# EAGLE design USB_Cocoon (EAGLE 5.04)
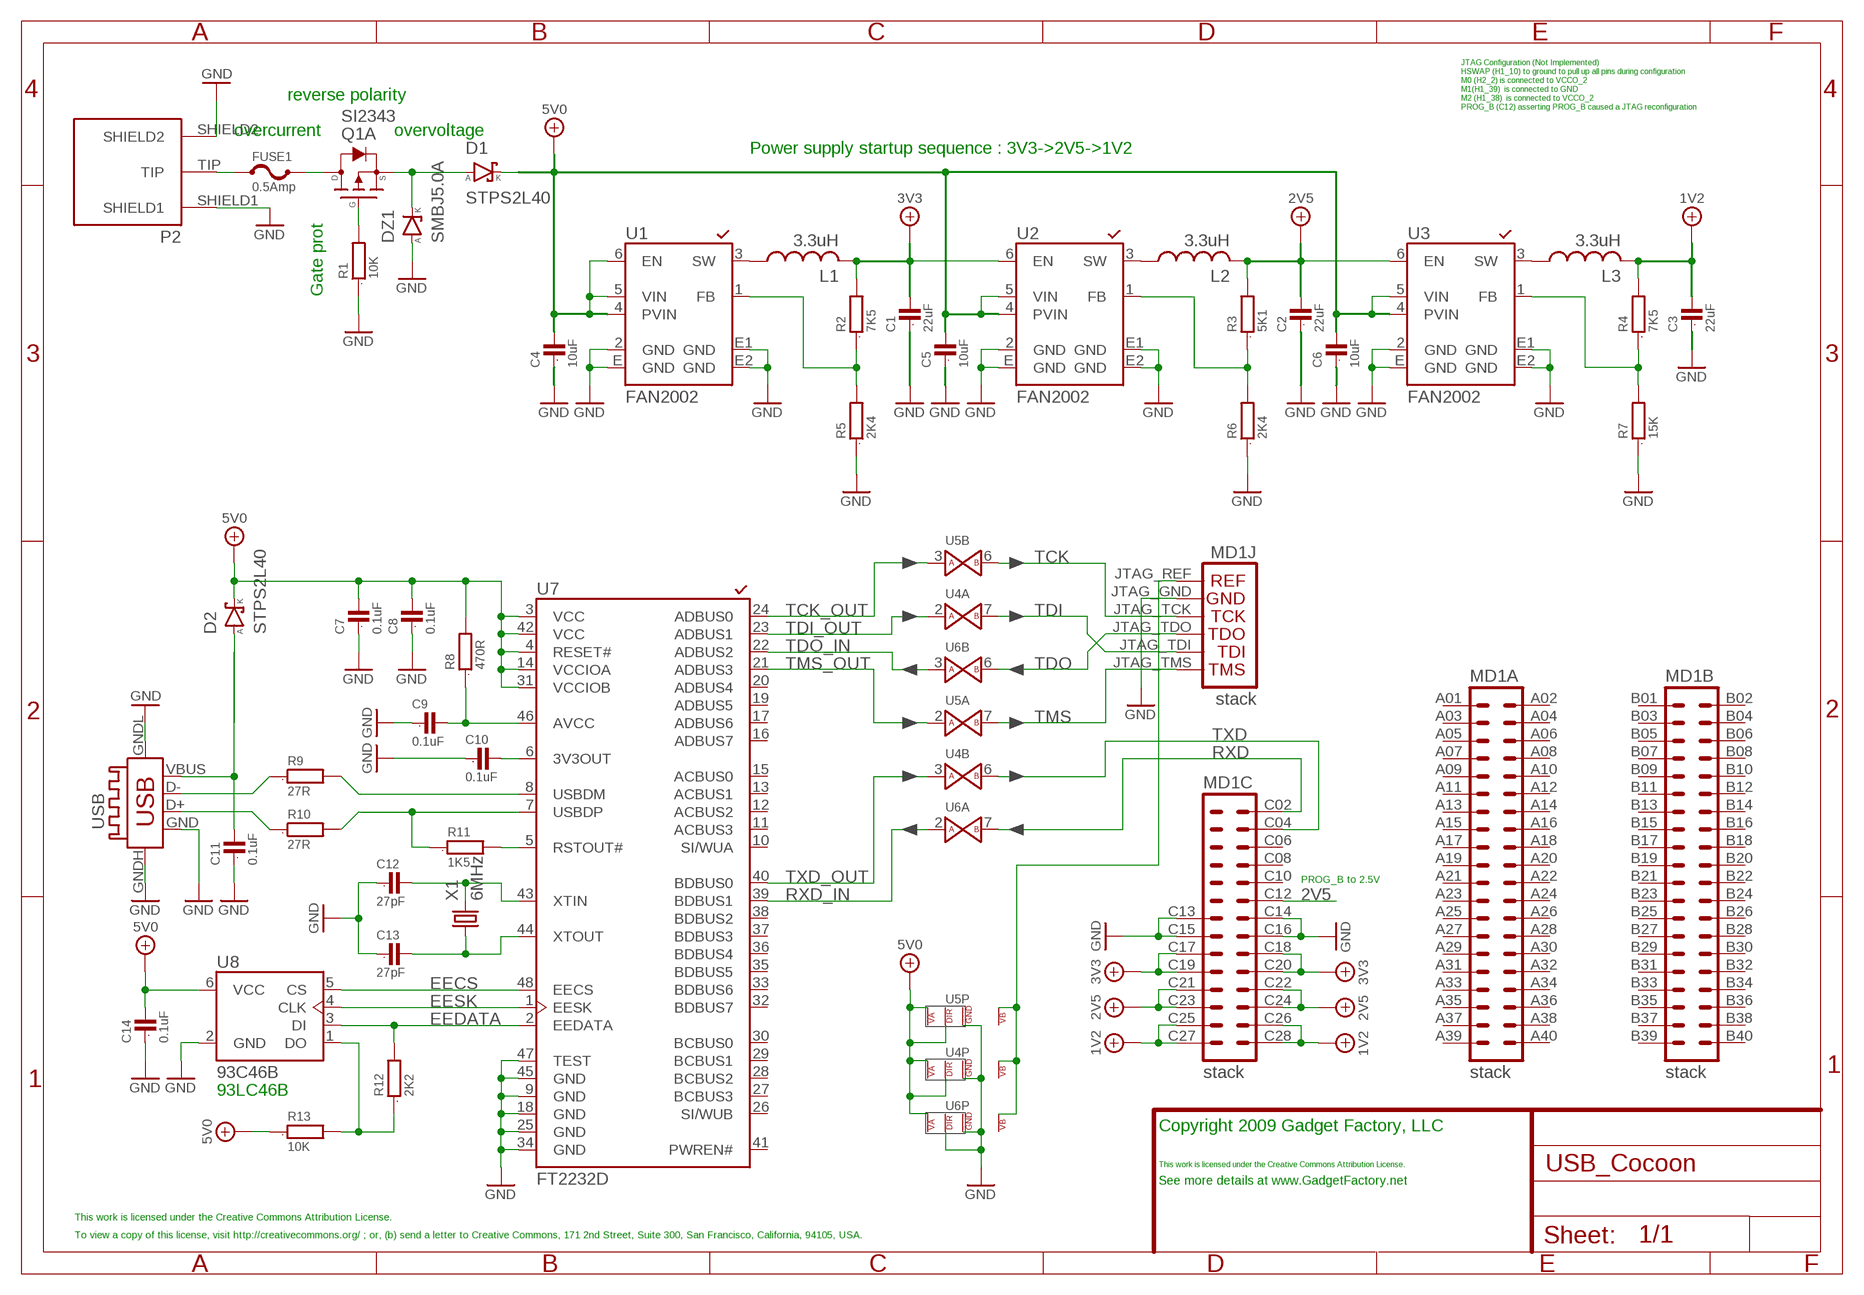
[diagram p0: schematic, sheet 1]

## Parts
C1  22uF  C0805  [0805]
C2  22uF  C0805  [0805]
C3  22uF  C0805  [0805]
C4  10uF  C0805  [0805]
C5  10uF  C0805  [0805]
C6  10uF  C0805  [0805]
C7  0.1uF  C0402  [0402]
C8  0.1uF  C0402  [0402]
C9  0.1uF  C0402  [0402]
C10  0.1uF  C0402  [0402]
C11  0.1uF  C0805  [0805]
C12  27pF  C0603  [0603]
C13  27pF  C0603  [0603]
C14  0.1uF  C0402  [0402]
D1  STPS2L40  DIODE-SCHOTTKY_SMB  [SMB]
D2  STPS2L40  DIODE-SCHOTTKY_SMB  [SMB]
DZ1  SMBJ5.0A  DIODE-ZENER_SMB  [SMB]
FUSE1  0.5Amp  FUSE1812  [1812]
L1  3.3uH  L-US1210  [1210]
L2  3.3uH  L-US1210  [1210]
L3  3.3uH  L-US1210  [1210]
MD1  stack  GADGETFACTORY_STACK  [GADGETFACTORY_STACK]
P2  POWER_JACK1THROUGH-HOLE  [POWER_JACK1]
Q1  SI2343  TRANSISTOR-MOSFET-P-ENH_SOT23-1  [SOT23]
R1  10K  R0402  [0402]
R2  7K5  R0402  [0402]
R3  5K1  R0402  [0402]
R4  7K5  R0402  [0402]
R5  2K4  R0402  [0402]
R6  2K4  R0402  [0402]
R7  15K  R0402  [0402]
R8  470R  R0402  [0402]
R9  27R  R0402  [0402]
R10  27R  R0402  [0402]
R11  1K5  R0402  [0402]
R12  2K2  R0402  [0402]
R13  10K  R0402  [0402]
U1  FAN2002  [MLP6]
U2  FAN2002  [MLP6]
U3  FAN2002  [MLP6]
U4  SN74LVC2T45  DIGITAL-TRANSLATOR-2G-DUAL_DCT  [MSOP8]
U5  SN74LVC2T45  DIGITAL-TRANSLATOR-2G-DUAL_DCT  [MSOP8]
U6  SN74LVC2T45  DIGITAL-TRANSLATOR-2G-DUAL_DCT  [MSOP8]
U7  FT2232D  [LQFP48]
U8  93C46B  DIGITAL-EEPROM-MICROWIRE-6P_SOT23  [SOT23-6]
USB  CON-USB-B  [USB-B-H]
X1  6MHz  CRYSTALHC49S  [HC49/S]

## Nets
1V2: C3.2 L3.2 MD1.C25(C:C25) MD1.C26(C:C26) MD1.C27(C:C27) MD1.C28(C:C28) R4.2
2V5: C2.2 L2.2 MD1.C12(C:C12) MD1.C21(C:C21) MD1.C22(C:C22) MD1.C23(C:C23) MD1.C24(C:C24) R3.2 U3.6(EN)
3V3: C1.2 L1.2 MD1.C17(C:C17) MD1.C18(C:C18) MD1.C19(C:C19) MD1.C20(C:C20) R2.2 U2.6(EN)
3V3OUT: C10.2 U7.6(3V3OUT)
5V0: C4.2 C5.2 C6.2 C7.2 C8.2 C14.2 D1.K D2.K R8.2 R13.1 U1.4(PVIN) U1.5(VIN) U1.6(EN) U2.4(PVIN) U2.5(VIN) U3.4(PVIN) U3.5(VIN) U4.1(P:VCCA) U4.5(P:DIR) U5.1(P:VCCA) U5.5(P:DIR) U6.1(P:VCCA) U7.3(VCC) U7.4(RESET#) U7.14(VCCIOA) U7.31(VCCIOB) U7.42(VCC) U8.6(VCC)
12V_FUSED: FUSE1.2 Q1.3(A:D)
12V_PROT: D1.A DZ1.K Q1.2(A:S)
D+: R10.1 USB.D+
D-: R9.1 USB.D-
DO: R12.1 R13.2 U8.1(DO)
EECS: U7.48(EECS) U8.5(CS)
EEDATA: R12.2 U7.2(EEDATA) U8.3(DI)
EESK: U7.1(EESK) U8.4(CLK)
FILTERED_VCC: C9.2 R8.1 U7.46(AVCC)
GND: C1.1 C2.1 C3.1 C4.1 C5.1 C6.1 C7.1 C8.1 C9.1 C10.1 C11.1 C12.1 C13.1 C14.1 DZ1.A MD1.C13(C:C13) MD1.C14(C:C14) MD1.C15(C:C15) MD1.C16(C:C16) MD1.JTAG_GND(J:JTAG_GND) P2.SHIELD1 P2.SHIELD2 R1.1 R5.1 R6.1 R7.1 U1.2(GND) U1.E1(GND) U1.E2(GND) U1.E(GND) U2.2(GND) U2.E1(GND) U2.E2(GND) U2.E(GND) U3.2(GND) U3.E1(GND) U3.E2(GND) U3.E(GND) U4.4(P:GND) U5.4(P:GND) U6.4(P:GND) U6.5(P:DIR) U7.9(GND) U7.18(GND) U7.25(GND) U7.34(GND) U7.45(GND) U7.47(TEST) U8.2(GND) USB.GND USB.GNDH USB.GNDL
N$1: L3.1 U3.3(SW)
N$2: L2.1 U2.3(SW)
N$3: R4.1 R7.2 U3.1(FB)
N$7: R3.1 R6.2 U2.1(FB)
N$8: L1.1 U1.3(SW)
N$9: R2.1 R5.2 U1.1(FB)
N$15: R11.2 U7.5(RSTOUT#)
REV_PROT_GATE: Q1.1(G:G) R1.2
RXD: MD1.C02(C:C02) U6.7(A:B)
RXD_IN: U6.2(A:A) U7.39(BDBUS1)
TCK: MD1.JTAG_TCK(J:JTAG_TCK) U5.6(B:B)
TCK_OUT: U5.3(B:A) U7.24(ADBUS0)
TDI: MD1.JTAG_TDI(J:JTAG_TDI) U4.7(A:B)
TDI_OUT: U4.2(A:A) U7.23(ADBUS1)
TDO: MD1.JTAG_TDO(J:JTAG_TDO) U6.6(B:B)
TDO_IN: U6.3(B:A) U7.22(ADBUS2)
TIP: FUSE1.1 P2.TIP
TMS: MD1.JTAG_TMS(J:JTAG_TMS) U5.7(A:B)
TMS_OUT: U5.2(A:A) U7.21(ADBUS3)
TXD: MD1.C04(C:C04) U4.6(B:B)
TXD_OUT: U4.3(B:A) U7.40(BDBUS0)
USBDM: R9.2 U7.8(USBDM)
USBDP: R10.2 R11.1 U7.7(USBDP)
VBUS: C11.2 D2.A USB.VBUS
VREF_BUF: MD1.JTAG_REF(J:JTAG_REF) U4.8(P:VCCB) U5.8(P:VCCB) U6.8(P:VCCB)
XTIN: C12.2 U7.43(XTIN) X1.2
XTOUT: C13.2 U7.44(XTOUT) X1.1
Unconnected: MD1.A01(A:A01) MD1.A02(A:A02) MD1.A03(A:A03) MD1.A04(A:A04) MD1.A05(A:A05) MD1.A06(A:A06) MD1.A07(A:A07) MD1.A08(A:A08) MD1.A09(A:A09) MD1.A10(A:A10) MD1.A11(A:A11) MD1.A12(A:A12) MD1.A13(A:A13) MD1.A14(A:A14) MD1.A15(A:A15) MD1.A16(A:A16) MD1.A17(A:A17) MD1.A18(A:A18) MD1.A19(A:A19) MD1.A20(A:A20) MD1.A21(A:A21) MD1.A22(A:A22) MD1.A23(A:A23) MD1.A24(A:A24) MD1.A25(A:A25) MD1.A26(A:A26) MD1.A27(A:A27) MD1.A28(A:A28) MD1.A29(A:A29) MD1.A30(A:A30) MD1.A31(A:A31) MD1.A32(A:A32) MD1.A33(A:A33) MD1.A34(A:A34) MD1.A35(A:A35) MD1.A36(A:A36) MD1.A37(A:A37) MD1.A38(A:A38) MD1.A39(A:A39) MD1.A40(A:A40) MD1.B01(B:B01) MD1.B02(B:B02) MD1.B03(B:B03) MD1.B04(B:B04) MD1.B05(B:B05) MD1.B06(B:B06) MD1.B07(B:B07) MD1.B08(B:B08) MD1.B09(B:B09) MD1.B10(B:B10) MD1.B11(B:B11) MD1.B12(B:B12) MD1.B13(B:B13) MD1.B14(B:B14) MD1.B15(B:B15) MD1.B16(B:B16) MD1.B17(B:B17) MD1.B18(B:B18) MD1.B19(B:B19) MD1.B20(B:B20) MD1.B21(B:B21) MD1.B22(B:B22) MD1.B23(B:B23) MD1.B24(B:B24) MD1.B25(B:B25) MD1.B26(B:B26) MD1.B27(B:B27) MD1.B28(B:B28) MD1.B29(B:B29) MD1.B30(B:B30) MD1.B31(B:B31) MD1.B32(B:B32) MD1.B33(B:B33) MD1.B34(B:B34) MD1.B35(B:B35) MD1.B36(B:B36) MD1.B37(B:B37) MD1.B38(B:B38) MD1.B39(B:B39) MD1.B40(B:B40) MD1.C06(C:C06) MD1.C08(C:C08) MD1.C10(C:C10) U7.10(SI/WUA) U7.11(ACBUS3) U7.12(ACBUS2) U7.13(ACBUS1) U7.15(ACBUS0) U7.16(ADBUS7) U7.17(ADBUS6) U7.19(ADBUS5) U7.20(ADBUS4) U7.26(SI/WUB) U7.27(BCBUS3) U7.28(BCBUS2) U7.29(BCBUS1) U7.30(BCBUS0) U7.32(BDBUS7) U7.33(BDBUS6) U7.35(BDBUS5) U7.36(BDBUS4) U7.37(BDBUS3) U7.38(BDBUS2) U7.41(PWREN#)

## Notes on the sheet
- JTAG Configuration (Not Implemented)
- HSWAP (H1_10) to ground to pull up all pins during configuration
- M0 (H2_2) is connected to VCCO_2
- M1(H1_39)  is connected to GND
- reverse polarity | M2 (H1_38)  is connected to VCCO_2
- PROG_B (C12) asserting PROG_B caused a JTAG reconfiguration
- overcurrent | overvoltage
- Power supply startup sequence : 3V3->2V5->1V2
- Gate prot
- PROG_B to 2.5V
- 93LC46B
- Copyright 2009 Gadget Factory, LLC
- This work is licensed under the Creative Commons Attribution License.
- See more details at www.GadgetFactory.net
- This work is licensed under the Creative Commons Attribution License.
- To view a copy of this license, visit http://creativecommons.org/ ; or, (b) send a letter to Creative Commons, 171 2nd Street, Suite 300, San Francisco, California, 94105, USA.

## Library data of the parts
C1-C14 = Bogdan_Commons:C: CAPACITOR, European symbol
D1 D2 = Bogdan_Commons:DIODE-SCHOTTKY
DZ1 = Bogdan_Commons:DIODE-ZENER
FUSE1 = GadgetFactory:FUSE
L1-L3 = GadgetFactory:L-US: INDUCTOR, American symbol
MD1 = GadgetFactory:GADGETFACTORY_STACK
P2 = GadgetFactory:POWER_JACK1
Q1 = Bogdan_Commons:TRANSISTOR-MOSFET-P-ENH
R1-R13 = Bogdan_Commons:R: RESISTOR, European symbol
U1-U3 = Bogdan_Commons:FAN2002
U4-U6 = Bogdan_Commons:DIGITAL-TRANSLATOR-2G-DUAL: SN74LVC2T45
U7 = Bogdan_Commons:FT2232D
U8 = Bogdan_Commons:DIGITAL-EEPROM-MICROWIRE-6P
USB = Bogdan_Commons:CON-USB-B
X1 = crystal:CRYSTAL: CRYSTAL

## Net classes
0 default: width 0.15 mm, drill 0.2 mm, clearance 0.125 mm

## Board
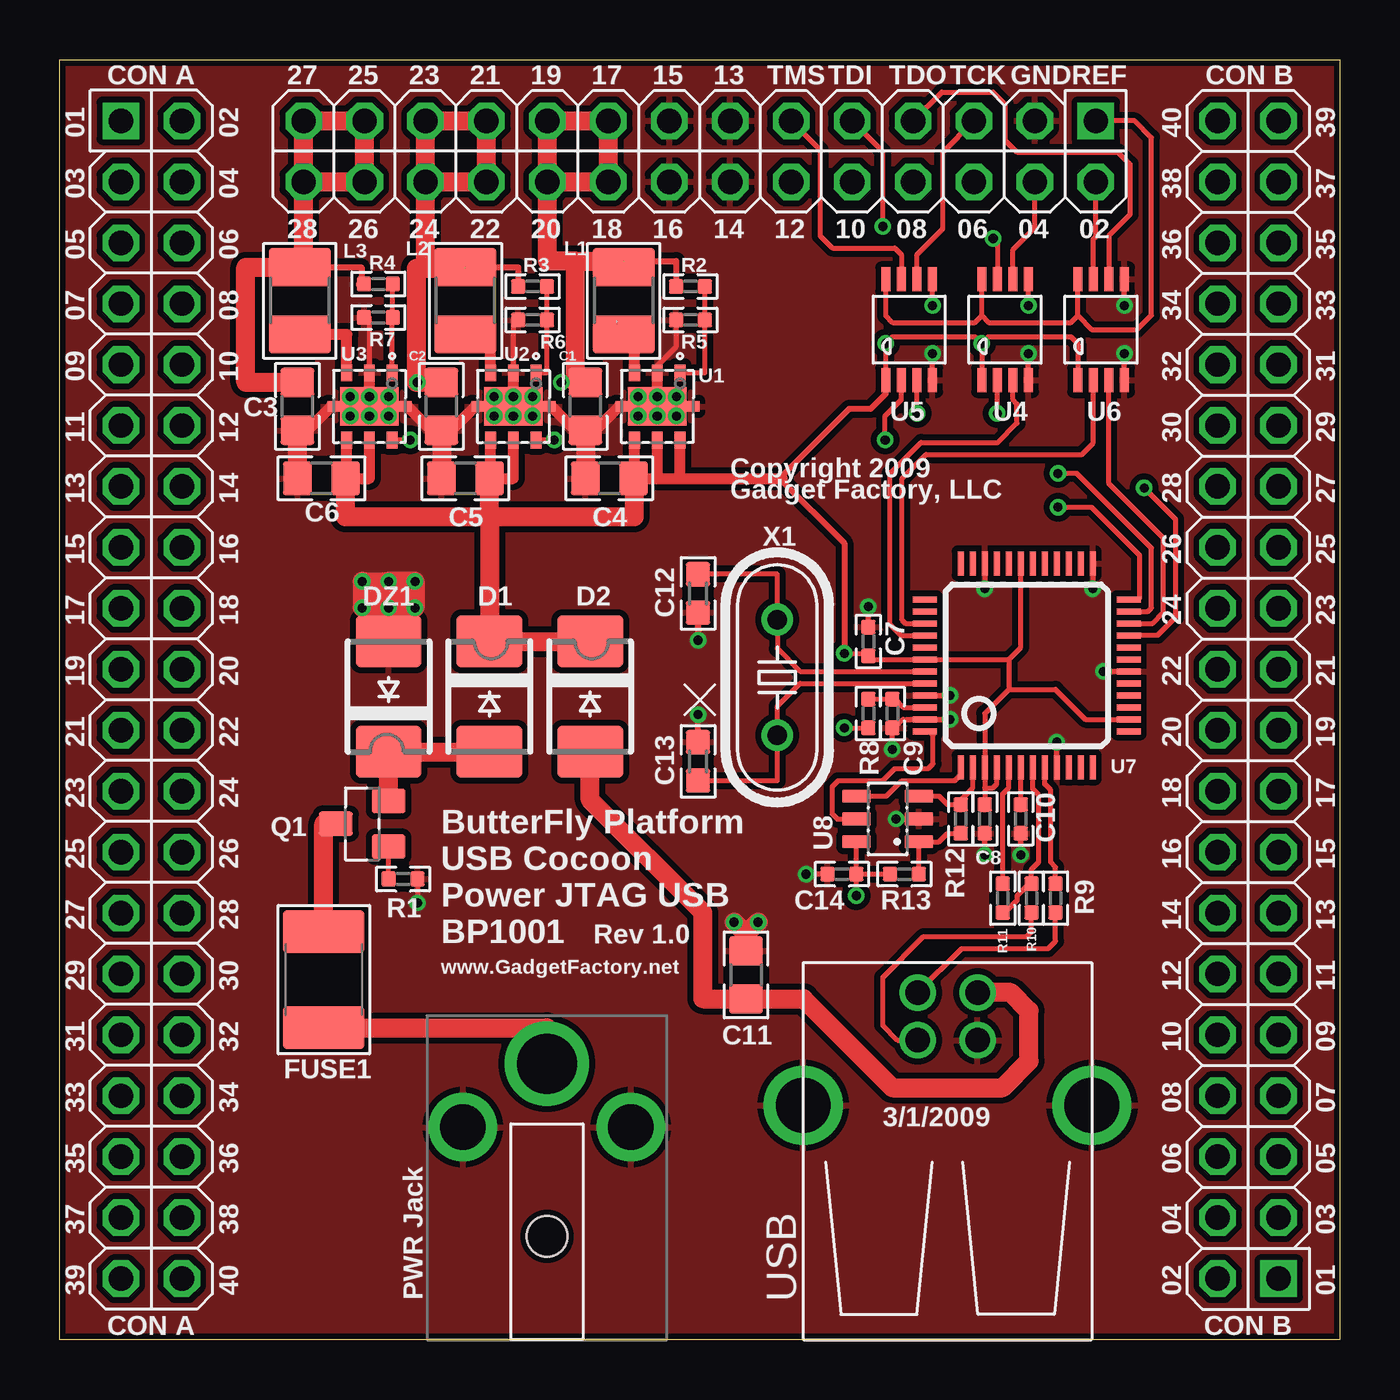
[diagram p1: board, top side]
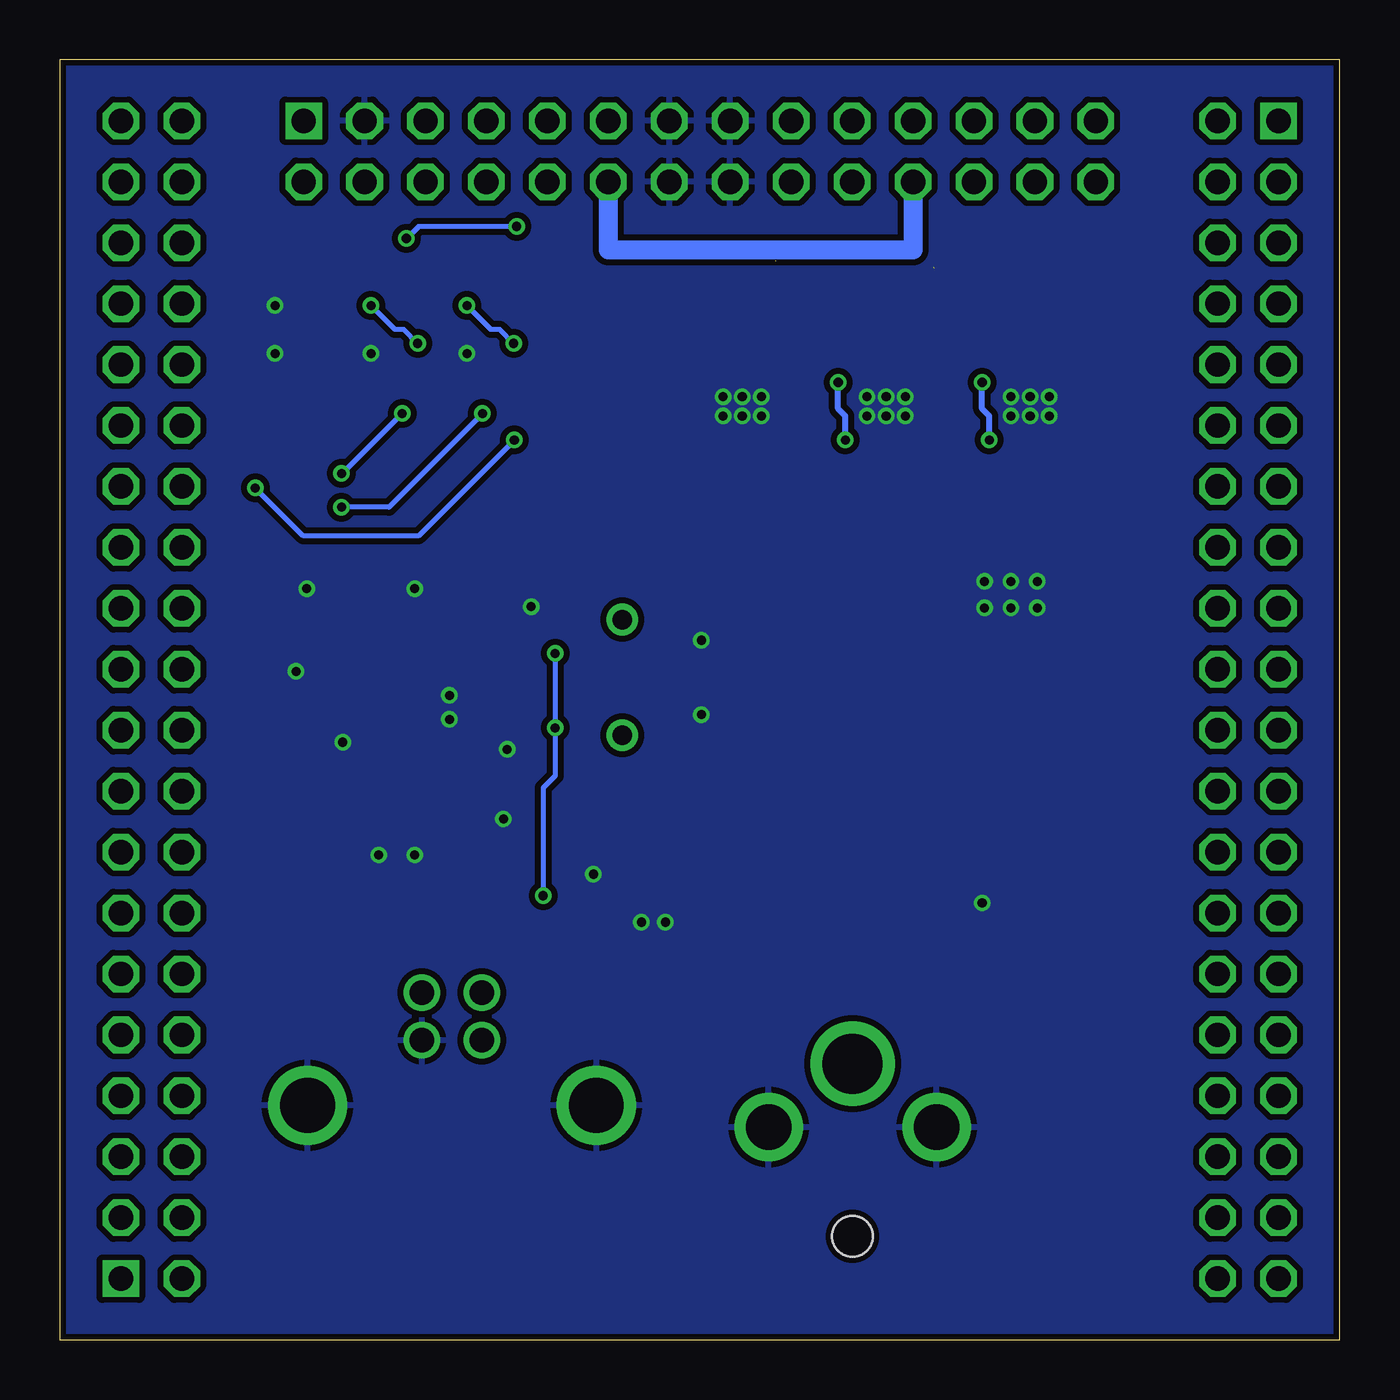
[diagram p2: board, bottom side, seen from below]

Size 53.34 x 53.34 mm. Coordinates in mm from the lower left corner, seen from the top.
Copper layers (1*16): Top 0.035mm / dielectric 1mm / Bottom 0.035mm
Design rules "default *": minimum track width 0.2mm, minimum drill 15mil, track to track 0.25mm, track to pad 0.25mm, pad to pad 0.25mm, via to via 0.25mm, smd to smd 0mil, copper to edge 10mil, drill to drill 8mil, minimum pad ring 10mil, minimum via ring 6mil, stop-mask expansion 4mil, vias tented up to drill 25mil, thermal gap 10mil

### Footprints (pad centres in the part's own frame; a part is rotated, then mirrored left to right if it is on the bottom)
0805 = smd 1.2 x 1.4: 1 -1,0; 2 1,0
0402 = smd 0.6 x 0.6: 1 -0.6,0; 2 0.6,0
0603 = smd 1 x 1: 1 -0.8,0; 2 0.8,0
SMB = smd 2.159 x 2.743: A 2.3,0; K -2.3,0
1812 = smd 1.8 x 3.4: 1 -2,0; 2 2,0
1210 = smd 1.6 x 2.6: 1 -1.4,0; 2 1.4,0
GADGETFACTORY_STACK = drill 1.016 square: A01 2.54,50.8; B01 50.8,2.54; JTAG_REF 43.18,50.8 | drill 1.016 octagon: A02 5.08,50.8; A03 2.54,48.26; A04 5.08,48.26; A05 2.54,45.72; A06 5.08,45.72; A07 2.54,43.18; A08 5.08,43.18; A09 2.54,40.64; A10 5.08,40.64; A11 2.54,38.1; A12 5.08,38.1; A13 2.54,35.56; A14 5.08,35.56; A15 2.54,33.02; A16 5.08,33.02; A17 2.54,30.48; A18 5.08,30.48; A19 2.54,27.94; A20 5.08,27.94; A21 2.54,25.4; A22 5.08,25.4; A23 2.54,22.86; A24 5.08,22.86; A25 2.54,20.32; A26 5.08,20.32; A27 2.54,17.78; A28 5.08,17.78; A29 2.54,15.24; A30 5.08,15.24; A31 2.54,12.7; A32 5.08,12.7; A33 2.54,10.16; A34 5.08,10.16; A35 2.54,7.62; A36 5.08,7.62; A37 2.54,5.08; A38 5.08,5.08; A39 2.54,2.54; A40 5.08,2.54; B02 48.26,2.54; B03 50.8,5.08; B04 48.26,5.08; B05 50.8,7.62; B06 48.26,7.62; B07 50.8,10.16; B08 48.26,10.16; B09 50.8,12.7; B10 48.26,12.7; B11 50.8,15.24; B12 48.26,15.24; B13 50.8,17.78; B14 48.26,17.78; B15 50.8,20.32; B16 48.26,20.32; B17 50.8,22.86; B18 48.26,22.86; B19 50.8,25.4; B20 48.26,25.4; B21 50.8,27.94; B22 48.26,27.94; B23 50.8,30.48; B24 48.26,30.48; B25 50.8,33.02; B26 48.26,33.02; B27 50.8,35.56; B28 48.26,35.56; B29 50.8,38.1; B30 48.26,38.1; B31 50.8,40.64; B32 48.26,40.64; B33 50.8,43.18; B34 48.26,43.18; B35 50.8,45.72; B36 48.26,45.72; B37 50.8,48.26; B38 48.26,48.26; B39 50.8,50.8; B40 48.26,50.8; C02 43.18,48.26; C04 40.64,48.26; C06 38.1,48.26; C08 35.56,48.26; C10 33.02,48.26; C12 30.48,48.26; C13 27.94,50.8; C14 27.94,48.26; C15 25.4,50.8; C16 25.4,48.26; C17 22.86,50.8; C18 22.86,48.26; C19 20.32,50.8; C20 20.32,48.26; C21 17.78,50.8; C22 17.78,48.26; C23 15.24,50.8; C24 15.24,48.26; C25 12.7,50.8; C26 12.7,48.26; C27 10.16,50.8; C28 10.16,48.26; JTAG_GND 40.64,50.8; JTAG_TCK 38.1,50.8; JTAG_TDI 33.02,50.8; JTAG_TDO 35.56,50.8; JTAG_TMS 30.48,50.8
POWER_JACK1 = drill 1.9 round: SHIELD1 -3.5,2.65; SHIELD2 3.5,2.65 | drill 2.5 round: TIP 0,0 | hole 1.7: 0,7.2
SOT23 = smd 1 x 1.4: 1 -0.95,-1.1; 2 0.95,-1.1; 3 0,1.1
MLP6 = smd 0.45 x 0.7: 1 -0.95,-1.4; 2 0,-1.4; 3 0.95,-1.4; 4 0.95,1.4; 5 0,1.4; 6 -0.95,1.4 | smd 2.45 x 1.6: E 0,0 | smd 0.7 x 0.45: E1 -1.4,0; E2 1.4,0
MSOP8 = smd 0.38 x 1: 1 -0.975,-2.1; 2 -0.325,-2.1; 3 0.325,-2.1; 4 0.975,-2.1; 5 0.975,2.1; 6 0.325,2.1; 7 -0.325,2.1; 8 -0.975,2.1
LQFP48 = smd 0.25 x 1: 1 -2.75,-4.25; 2 -2.25,-4.25; 3 -1.75,-4.25; 4 -1.25,-4.25; 5 -0.75,-4.25; 6 -0.25,-4.25; 7 0.25,-4.25; 8 0.75,-4.25; 9 1.25,-4.25; 10 1.75,-4.25; 11 2.25,-4.25; 12 2.75,-4.25; 25 2.75,4.25; 26 2.25,4.25; 27 1.75,4.25; 28 1.25,4.25; 29 0.75,4.25; 30 0.25,4.25; 31 -0.25,4.25; 32 -0.75,4.25; 33 -1.25,4.25; 34 -1.75,4.25; 35 -2.25,4.25; 36 -2.75,4.25 | smd 1 x 0.25: 13 4.25,-2.75; 14 4.25,-2.25; 15 4.25,-1.75; 16 4.25,-1.25; 17 4.25,-0.75; 18 4.25,-0.25; 19 4.25,0.25; 20 4.25,0.75; 21 4.25,1.25; 22 4.25,1.75; 23 4.25,2.25; 24 4.25,2.75; 37 -4.25,2.75; 38 -4.25,2.25; 39 -4.25,1.75; 40 -4.25,1.25; 41 -4.25,0.75; 42 -4.25,0.25; 43 -4.25,-0.25; 44 -4.25,-0.75; 45 -4.25,-1.25; 46 -4.25,-1.75; 47 -4.25,-2.25; 48 -4.25,-2.75
SOT23-6 = smd 0.55 x 1.2: 1 -0.95,-1.3; 2 0,-1.3; 3 0.95,-1.3; 4 0.95,1.3; 5 0,1.3; 6 -0.95,1.3
USB-B-H = drill 1.016 round: D+ 5.08,1.25; D- 7.061,1.25; GND 5.08,-1.25; VBUS 7.061,-1.25 | drill 2.286 round: GNDH 2.362,6.02; GNDL 2.362,-6.02
HC49/S = drill 0.813 round: 1 -2.413,0; 2 2.413,0

### Placement (x,y rotation side)
C1  21.9,38.9 90 top
C2  15.9,38.9 90 top
C3  9.9,38.9 90 top
C4  22.9,35.9 0 top
C5  16.9,35.9 0 top
C6  10.9,35.9 0 top
C7  33.7,29.1 270 top
C8  38.55,21.7 90 top
C9  34.7,26.1 90 top
C10  40.05,21.7 90 top
C11  28.6,15.2 270 top
C12  26.6,31.1 90 top
C13  26.6,24.1 270 top
C14  32.6,19.4 0 top
D1  17.9,26.8 270 top
D2  22.1,26.8 270 top
DZ1  13.7,26.8 90 top
FUSE1  11,15 90 top
L1  23.5,43.3 90 top
L2  16.9,43.3 90 top
L3  10,43.3 90 top
MD1  0,0 0 top
P2  20.3,11.5 180 top
Q1  12.6,21.5 90 top
R1  14.3,19.2 180 top
R2  26.28,43.9 180 top
R3  19.7,43.9 180 top
R4  13.27,44 180 top
R5  26.28,42.5 0 top
R6  19.7,42.5 0 top
R7  13.27,42.6 0 top
R8  33.7,26.1 270 top
R9  41.5,18.4 90 top
R10  40.5,18.4 90 top
R11  39.3,18.4 90 top
R12  37.55,21.7 90 top
R13  35.2,19.4 0 top
U1  24.9,38.9 180 top
U2  18.9,38.9 180 top
U3  12.9,38.9 180 top
U4  39.4,42.1 0 top
U5  35.4,42.1 0 top
U6  43.4,42.1 0 top
U7  40.3,28.1 0 top
U8  34.5,21.7 90 top
USB  37,7.4 90 top
X1  29.9,27.6 90 top

### Tracks (layer width: path | path; a pad name or v marks a point on that pad's centre or on a via)
1V2
  Top 0.25: 12.57,43.98 12.57,44.7 L3.2
  Top 0.45: R4.2 12.67,43.98 12.57,43.98
  Top 0.8: MD1.C28 MD1.C27 MD1.C25 MD1.C26 MD1.C28 | C3.2 7.75,39.9 7.75,44.7 L3.2 10.16,44.7 MD1.C28 | MD1.C28 10.03,48.26
2V5  (via drill 0.38)  (1 unrouted)
  Top 0.25: v14.9,39.9 15.57,39.9 | U3.6 v14.6,37.5 | R3.2 19.1,44.7 L2.2
  Top 0.8: 15.57,39.9 C2.2 14.86,39.9 14.86,44.66 | MD1.C24 MD1.C23 MD1.C21 MD1.C22 MD1.C24 | 14.86,44.66 16.89,44.66 | 14.86,44.66 15.24,44.66 MD1.C24
  Bottom 0.25: v14.6,37.5 14.6,38.5 14.9,38.8 v14.9,39.9
  Bottom 0.8: MD1.C12 30.48,45.42 17.78,45.42 MD1.C22
3V3  (via drill 0.38)  (1 unrouted)
  Top 0.25: v20.9,39.9 21.48,39.9 | U2.6 v20.6,37.5 | 23.51,44.96 25.68,44.96 R2.2
  Top 0.8: MD1.C20 MD1.C19 MD1.C17 MD1.C18 MD1.C20 | C1.2 21.48,39.9 21.48,44.96 | MD1.C20 20.32,44.96 21.48,44.96 | 21.48,44.96 23.5,44.96 L1.2
  Bottom 0.25: v20.6,37.5 20.6,38.5 20.9,38.8 v20.9,39.9
3V3OUT
  Top 0.2: C10.2 U7.6
5V0  (via drill 0.38)
  Top 0.2: 38.55,23 C8.2 | 38.55,23 U7.3 38.55,26.1 39.55,27.1 | C14.2 U8.6 | C14.2 R13.1 | 38.55,23 38.9,23 39.05,23.15 U7.4 | 39.55,28.35 U7.42 33.7,28.35 C7.2 33.7,28.6 v32.7,28.6 | U7.31 40.05,28.85 39.55,28.35 | 39.55,28.35 39.55,27.1 | U7.14 42.75,25.85 41.5,27.1 39.55,27.1 | U5.1 v34.42,41.52 34.7,41.8 38.15,41.8 v38.42,41.52 | v38.42,41.52 U4.1 | U6.1 42.42,41.52 42.15,41.8 38.7,41.8 v38.42,41.52 | v40.38,43.1 U4.5 | v36.38,43.1 U5.5 | v32.7,25.5 R8.2 | v33.2,18.5 C14.2
  Top 0.25: U5.1 34.42,39.42 33.8,38.8 32.9,38.8 30,35.9 32.7,33.2 v32.7,28.6
  Top 0.45: 23.95,35.9 U1.4 | 17.95,35.9 U2.4 | U3.4 11.95,35.9 C6.2 12.9,35.9 U3.5 | U2.5 18.9,35.9 17.95,35.9 | C5.2 17.95,35.9 | 24.9,35.9 U1.5 | 23.95,35.9 C4.2 | 23.95,35.9 24.9,35.9 | 25.85,35.9 U1.6 | 24.9,35.9 25.85,35.9 | 25.85,35.9 30,35.9 30.1,35.9
  Top 0.8: 17.9,34.3 11.9,34.3 C6.2 | 17.9,34.3 23.95,34.3 23.95,35.9 | 17.9,34.3 C5.2 | D2.K D1.K 17.9,34.3
  Bottom 0.2: v36.38,43.1 35.38,42.1 35,42.1 v34.42,41.52 | v40.38,43.1 39.38,42.1 39,42.1 v38.42,41.52 | v32.7,28.6 v32.7,25.5 32.7,23.5 33.2,23 v33.2,18.5
12V_FUSED
  Top 0.8: Q1.3 11,21.5 FUSE1.2
12V_PROT
  Top 0.8: D1.A DZ1.K Q1.2
D+
  Top 0.2: R10.1 40.5,17 40.3,16.8 36,16.8 34.3,15.1 34.3,13.1 34.92,12.48 USB.D+
D-
  Top 0.2: USB.D- 37.59,16.3 41.2,16.3 41.5,16.6 R9.1
DO
  Top 0.2: R12.1 37,21.1 36.65,20.75 U8.1 R13.2
EECS
  Top 0.2: U8.5 32.4,21.7 32.2,21.9 32.2,23.05 32.45,23.3 34.3,23.3 34.8,23.8 36.2,23.8 36.4,24 36.4,25.2 36.25,25.35 U7.48
EEDATA
  Top 0.2: U7.2 38.05,23 37.55,22.5 R12.2 37,22.3 36.65,22.65 U8.3
EESK
  Top 0.2: U8.4 34.45,22.65 35.1,23.3 37.3,23.3 37.55,23.55 U7.1
FILTERED_VCC
  Top 0.2: U7.46 35.15,26.35 34.8,26.7 C9.2 R8.1
GND  (via drill 0.38)
  Top 0.2: U1.E1 U1.E U1.E2 | U2.E1 U2.E U2.E2 | U3.E1 U3.E U3.E2 | v40.05,20.2 C10.1 | U7.9 v41.55,24.9 | U7.18 v43.5,27.85 | U7.25 v43.05,31.3 | U7.34 v38.55,31.3 | v38.55,20.2 C8.1 | U7.45 v37.1,26.85 | v37.1,25.85 U7.47 35.15,25.85 34.8,25.5 C9.1 v34.7,24.6 | v34.85,21.7 U8.2 | C14.1 v31.1,19.4 | C7.1 v33.7,30.55 | U5.4 v36.38,41.1 | U4.4 v40.38,41.1 | U6.4 v44.38,41.1 | v44.38,43.1 U6.5 | R1.1 v14.9,18.2 | U3.2 12.9,42.6 R7.1 | U2.2 18.9,42.5 R6.1 | U1.2 24.9,40.6 25.7,41.4 25.7,42.5 R5.1
  Top 0.25: C12.1 v26.6,29.15 | C13.1 v26.6,26.05
  Top 0.45: U3.2 U3.E v12.9,38.5 | U2.E U2.2 | U1.E U1.2 | U1.E2 23.3,38.9 22.3,37.9 C1.1 21.5,37.9 20.5,38.9 U2.E1 | U3.E1 14.5,38.9 15.5,37.9 C2.1 16.3,37.9 17.3,38.9 U2.E2 | C3.1 10.3,37.9 11.3,38.9 U3.E2
  Top 0.8: C6.1 C3.1 | C2.1 C5.1 | C1.1 C4.1 | v13.7,30.5 v12.6,31.6 | v12.6,30.5 v13.7,31.6 | v14.8,30.5 v13.7,31.6 | v13.7,30.5 v14.8,31.6 | v12.6,31.6 v12.6,30.5 | v13.7,30.5 v12.6,30.5 | DZ1.A v13.7,30.5 | v13.7,30.5 v14.8,30.5 | v14.8,31.6 v14.8,30.5 | v12.6,31.6 v13.7,31.6 | v14.8,31.6 v13.7,31.6 | C11.1 28.6,16.9 | 28.6,16.9 v28.1,17.4 | 28.6,16.9 v29.1,17.4
  other vias: 12.1,39.3 12.9,39.3 12.1,38.5 13.7,39.3 13.7,38.5 18.9,39.3 18.9,38.5 18.1,39.3 18.1,38.5 19.7,39.3 19.7,38.5 24.9,39.3 24.9,38.5 24.1,39.3 24.1,38.5 25.7,39.3 25.7,38.5
  pour Bottom (isolate 0.25): 0,53.34 53.34,53.34 53.34,0 0,0
  pour Top (isolate 0.25): 0,53.34 53.34,53.34 53.34,0 0,0
N$1
  Top 0.45: U3.3 11.95,41.9 L3.1
N$2
  Top 0.45: U2.3 17.95,41.9 L2.1
N$3
  Top 0.2: R4.1 R7.2 13.85,42.6 U3.1
N$7
  Top 0.2: R3.1 R6.2 20.3,40.3 U2.1
N$8
  Top 0.45: U1.3 23.95,41.9 L1.1
N$9
  Top 0.2: R2.1 R5.2 26.88,40.3 U1.1
N$15
  Top 0.2: U7.5 39.55,23 39.3,22.75 R11.2
REV_PROT_GATE
  Top 0.2: R1.2 Q1.1
RXD
  Top 0.2: U6.7 43.08,45.88 43.18,45.98 MD1.C02
RXD_IN
  Top 0.2: U7.39 35.25,29.85 35.1,30 35.1,35.9 36.1,36.9 42.6,36.9 43.08,37.38 U6.2
TCK
  Top 0.2: MD1.JTAG_TCK 36.8,49.5 36.8,46.3 35.73,45.23 U5.6
TCK_OUT  (via drill 0.38)
  Top 0.2: U7.24 44.95,30.85 45,30.9 45,32.7 43,34.7 v41.6,34.7 | v35.73,38.6 U5.3
  Bottom 0.2: v41.6,34.7 39.62,34.7 v35.73,38.6
TDI  (via drill 0.38)
  Top 0.2: MD1.JTAG_TDI 34.3,49.52 v34.3,46.4 | U4.7 39.08,45.73 v38.9,45.9
  Bottom 0.2: v34.3,46.4 38.4,46.4 v38.9,45.9
TDI_OUT  (via drill 0.38)
  Top 0.2: U7.23 45.35,30.35 45.5,30.5 45.5,33 42.4,36.1 v41.6,36.1 | v39.08,38.6 U4.2
  Bottom 0.2: v39.08,38.6 41.58,36.1 v41.6,36.1
TDO
  Top 0.2: MD1.JTAG_TDO 36.76,52 38.9,52 39.4,51.5 39.4,50 39.9,49.5 44.1,49.5 44.6,49 44.6,46.9 43.73,46.02 U6.6
TDO_IN
  Top 0.2: U7.22 45.55,29.85 46,30.3 46,33.4 43.73,35.67 U6.3
TIP
  Top 0.8: FUSE1.1 20.3,13 P2.TIP
TMS
  Top 0.2: U5.7 35.08,45.23 34.8,45.5 32.2,45.5 31.7,46 31.7,49.58 MD1.JTAG_TMS
TMS_OUT  (via drill 0.38)
  Top 0.2: U7.21 45.75,29.35 46.5,30.1 46.5,34.2 v45.2,35.5 | U5.2 35.08,39.17 34.4,38.5 v34.4,37.5
  Bottom 0.2: v45.2,35.5 43.2,33.5 38.4,33.5 v34.4,37.5
TXD
  Top 0.2: MD1.C04 40.64,46.34 39.73,45.42 U4.6
TXD_OUT
  Top 0.2: U7.40 35.05,29.35 34.6,29.8 34.6,36.1 35.9,37.4 39.1,37.4 39.9,38.2 39.9,39 39.73,39.17 U4.3
USBDM
  Top 0.2: U7.8 41.05,23.15 41.3,22.9 41.3,19.9 41.5,19.7 R9.2
USBDP
  Top 0.2: U7.7 40.55,22.95 40.8,22.7 40.8,19.9 40.5,19.6 R10.2 40.4,19 39.9,18.5 39.9,18.3 39.4,17.8 R11.1
VBUS
  Top 0.8: USB.VBUS 39.64,14.46 40.4,13.7 40.4,11.6 39.3,10.5 34.7,10.5 31,14.2 C11.2 26.8,14.2 26.8,17.8 22.1,22.5 D2.A
VREF_BUF
  Top 0.2: U5.8 34.42,42.67 34.7,42.4 38.15,42.4 38.42,42.67 | 38.42,42.67 U4.8 | 42.42,42.67 U6.8 | 42.42,42.67 42.15,42.4 38.7,42.4 38.42,42.67 | MD1.JTAG_REF 44.8,50.8 45.5,50.1 45.5,42.7 44.9,42.1 43,42.1 42.42,42.67
XTIN
  Top 0.2: U7.43 30.85,27.85 29.9,28.8 X1.2 29.9,31.9 C12.2
XTOUT
  Top 0.2: U7.44 30.85,27.35 29.9,26.4 X1.1 29.9,23.3 C13.2

### Text on the board
tPlace: Copyright 2009 | Gadget Factory, LLC | ButterFly Platform | USB Cocoon | Power JTAG USB | BP1001 | Rev 1.0 | www.GadgetFactory.net | 3/1/2009 | PWR Jack